# EAGLE design pic18f46k22_evb (EAGLE 7.0.0)
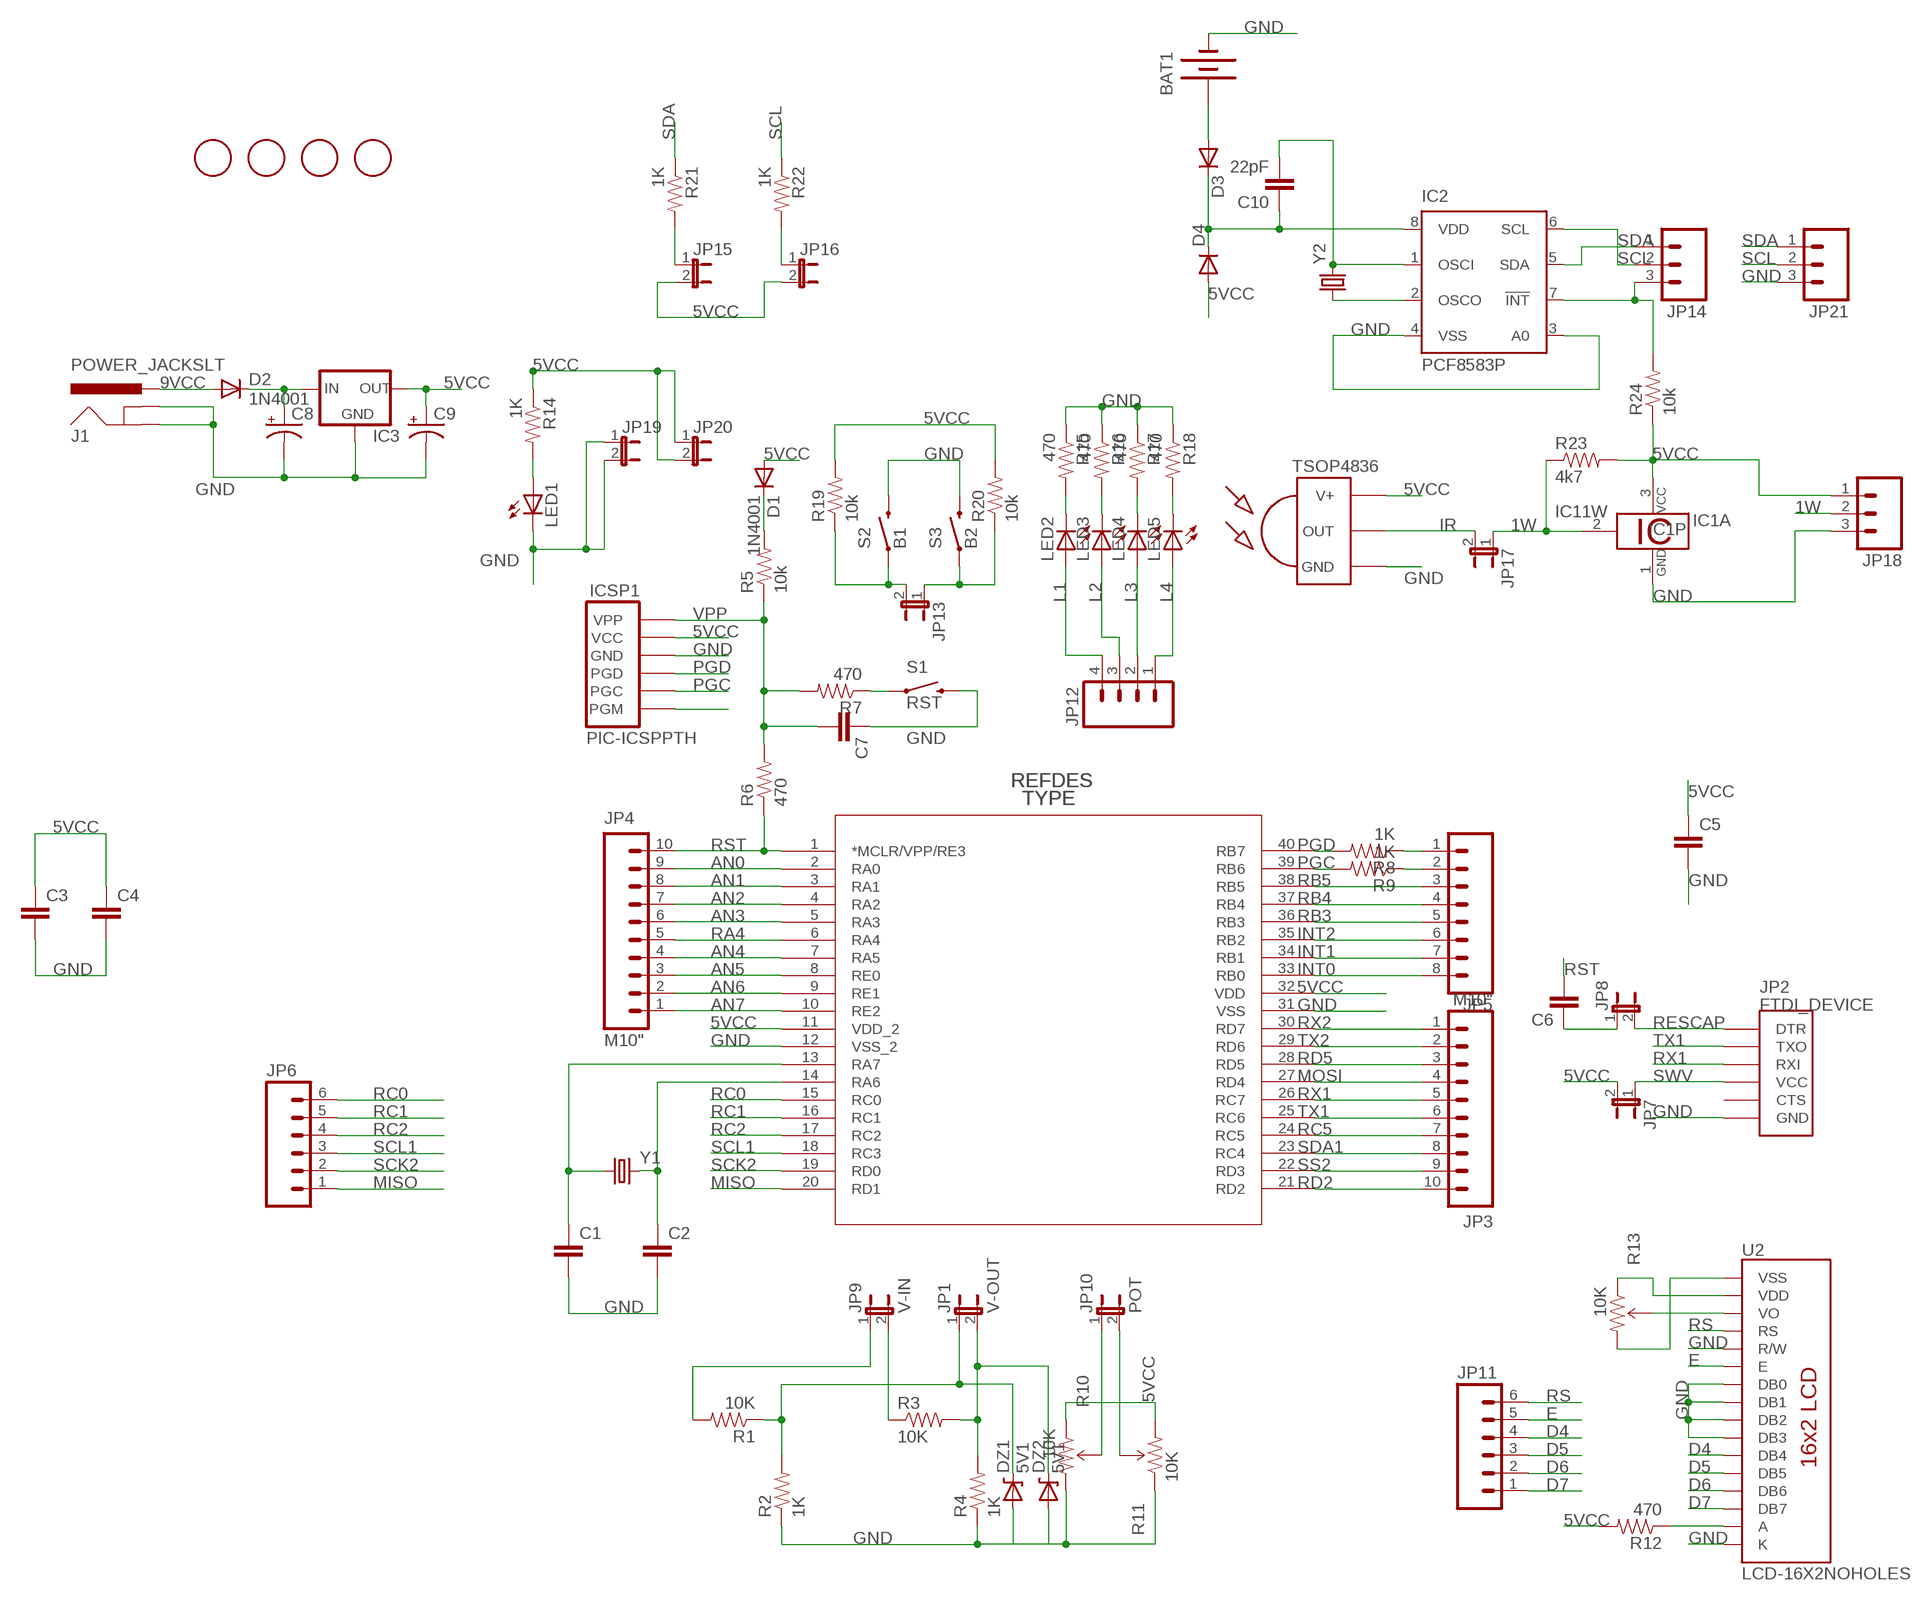
[diagram p0: schematic, sheet 1]

## Parts
BAT1  BATTERY12MM  [BATTCON_12MM]
C1  CAPPTH1  [CAP-PTH-5MM]
C2  CAPPTH1  [CAP-PTH-5MM]
C3  CAPPTH1  [CAP-PTH-5MM]
C4  CAPPTH1  [CAP-PTH-5MM]
C5  CAPPTH1  [CAP-PTH-5MM]
C6  CAPPTH1  [CAP-PTH-5MM]
C7  CAPPTH1  [CAP-PTH-5MM]
C8  CAP_POLPTH1  [CPOL-RADIAL-100UF-25V]
C9  CAP_POLPTH2  [CPOL-RADIAL-10UF-25V]
C10  22pF  CAPPTH1  [CAP-PTH-5MM]
D1  1N4001  DIODEPTH  [DIODE-1N4001]
D2  1N4001  DIODEPTH  [DIODE-1N4001]
D3  DIODE1N4148  [DIODE-1N4148]
D4  DIODE1N4148  [DIODE-1N4148]
DZ1  5V1  DIODE-ZENERPTH  [DIODE-ZENER]
DZ2  5V1  DIODE-ZENERPTH  [DIODE-ZENER]
IC1  DS18B20  [TO92-]
IC2  PCF8583P  [DIL08]
IC3  V_REG_78XXSINK  [TO220-IGO]
ICSP1  PIC-ICSPPTH  [MOLEX-1X6]
J1  POWER_JACKSLT  [POWER_JACK_SLOT]
JP1  V-OUT  JUMPER-2PTH  [1X02]
JP2  FTDI_DEVICE  [FTDI_DEVICE_SIDE]
JP3  M10"  [1X10]
JP4  M10"  [1X10]
JP5  M081X08  [1X08]
JP6  M06SIP  [1X06]
JP7  JUMPER-2PTH  [1X02]
JP8  JUMPER-2PTH  [1X02]
JP9  V-IN  JUMPER-2PTH  [1X02]
JP10  POT  JUMPER-2PTH  [1X02]
JP11  M06SIP  [1X06]
JP12  M04PTH  [1X04]
JP13  JUMPER-2PTH  [1X02]
JP14  M03PTH  [1X03]
JP15  JUMPER-2PTH  [1X02]
JP16  JUMPER-2PTH  [1X02]
JP17  JUMPER-2PTH  [1X02]
JP18  M03PTH  [1X03]
JP19  JUMPER-2PTH  [1X02]
JP20  JUMPER-2PTH  [1X02]
JP21  M03PTH  [1X03]
LED1  LED3MM  [LED3MM]
LED2  LED3MM  [LED3MM]
LED3  LED3MM  [LED3MM]
LED4  LED3MM  [LED3MM]
LED5  LED3MM  [LED3MM]
R1  10K  RESISTORAXIAL-0.3  [AXIAL-0.3]
R2  1K  RESISTORAXIAL-0.3  [AXIAL-0.3]
R3  10K  RESISTORAXIAL-0.3  [AXIAL-0.3]
R4  1K  RESISTORAXIAL-0.3  [AXIAL-0.3]
R5  10k  RESISTORAXIAL-0.3  [AXIAL-0.3]
R6  470  RESISTORAXIAL-0.3  [AXIAL-0.3]
R7  470  RESISTORAXIAL-0.3  [AXIAL-0.3]
R8  1K  RESISTORAXIAL-0.3  [AXIAL-0.3]
R9  1K  RESISTORAXIAL-0.3  [AXIAL-0.3]
R10  10K  TRIMPOTPTH  [TRIM_POT_PTH]
R11  10K  TRIMPOTPTH  [TRIM_POT_PTH]
R12  470  RESISTORAXIAL-0.3  [AXIAL-0.3]
R13  10K  TRIMPOTPTH  [TRIM_POT_PTH]
R14  1K  RESISTORAXIAL-0.3  [AXIAL-0.3]
R15  470  RESISTORAXIAL-0.3  [AXIAL-0.3]
R16  470  RESISTORAXIAL-0.3  [AXIAL-0.3]
R17  470  RESISTORAXIAL-0.3  [AXIAL-0.3]
R18  470  RESISTORAXIAL-0.3  [AXIAL-0.3]
R19  10k  RESISTORAXIAL-0.3  [AXIAL-0.3]
R20  10k  RESISTORAXIAL-0.3  [AXIAL-0.3]
R21  1K  RESISTORAXIAL-0.3  [AXIAL-0.3]
R22  1K  RESISTORAXIAL-0.3  [AXIAL-0.3]
R23  4k7  RESISTORAXIAL-0.3  [AXIAL-0.3]
R24  10k  RESISTORAXIAL-0.3  [AXIAL-0.3]
S1  RST  SWITCH-MOMENTARY-2PTH  [TACTILE-PTH]
S2  B1  SWITCH-MOMENTARY-2PTH  [TACTILE-PTH]
S3  B2  SWITCH-MOMENTARY-2PTH  [TACTILE-PTH]
U1  PIC18F46K22  MICROCHIP_PIC18F46K22-X_P  [MICROCHIP_PDIP40_600MC]
U2  LCD-16X2NOHOLES  [LCD-16X2_NOHOLES]
U$1  MOUNTINGHOLE3.0THIN  [MOUNTINGHOLE_3.0_PLATEDTHIN]
U$2  MOUNTINGHOLE3.0THIN  [MOUNTINGHOLE_3.0_PLATEDTHIN]
U$3  MOUNTINGHOLE3.0THIN  [MOUNTINGHOLE_3.0_PLATEDTHIN]
U$4  MOUNTINGHOLE3.0THIN  [MOUNTINGHOLE_3.0_PLATEDTHIN]
U$5  TSOP4836  [TSOP18XX]
Y1  CRYSTALHC49UV  [HC49U-V]
Y2  CRYSTALTC38H  [TC38H]

## Nets
1W: IC1.2 JP17.1 JP18.2 R23.P$1
5VCC: C3.1 C4.1 C5.1 C9.1(+) D1.A D4.A IC1.3 IC3.OUT ICSP1.5(VCC) JP7.2 JP15.2 JP16.2 JP18.1 JP20.1 JP20.2 R10.1(CCW) R11.3(CW) R12.P$2 R13.1(CCW) R14.P$1 R19.P$2 R20.P$2 R23.P$2 R24.P$1 U1.11(VDD_2) U1.32(VDD) U2.2(VDD) U$5.VCC(V+)
9VCC: D2.A J1.PWR
AN0: JP4.9 U1.2(RA0)
AN1: JP4.8 U1.3(RA1)
AN2: JP4.7 U1.4(RA2)
AN3: JP4.6 U1.5(RA3)
AN4: JP4.4 U1.7(RA5)
AN5: JP4.3 U1.8(RE0)
AN6: JP4.2 U1.9(RE1)
AN7: JP4.1 U1.10(RE2)
D4: JP11.4 U2.11(DB4)
D5: JP11.3 U2.12(DB5)
D6: JP11.2 U2.13(DB6)
D7: JP11.1 U2.14(DB7)
E: JP11.5 U2.6(E)
GND: BAT1.GND(-) C1.2 C2.2 C3.2 C4.2 C5.2 C7.1 C8.2(-) C9.2(-) DZ1.P$2(A) DZ2.P$2(A) IC1.1 IC2.3(A0) IC2.4(VSS) IC3.GND ICSP1.4(GND) J1.GND@1(GNDBREAK) J1.GND@2(GND) JP2.P$6(GND) JP18.3 JP19.1 JP19.2 JP21.3 LED1.K(C) R2.P$1 R4.P$1 R10.3(CW) R11.1(CCW) R13.3(CW) R15.P$1 R16.P$1 R17.P$1 R18.P$1 S1.3 S2.3 S3.3 U1.12(VSS_2) U1.31(VSS) U2.1(VSS) U2.5(R/W) U2.7(DB0) U2.8(DB1) U2.9(DB2) U2.10(DB3) U2.16(K) U$5.GND
INT0: JP5.8 U1.33(RB0)
INT1: JP5.7 U1.34(RB1)
INT2: JP5.6 U1.35(RB2)
IR: JP17.2 U$5.OUT
L1: JP12.4 LED2.A
L2: JP12.3 LED3.A
L3: JP12.2 LED4.A
L4: JP12.1 LED5.A
MISO: JP6.1 U1.20(RD1)
MOSI: JP3.4 U1.27(RD4)
N$1: C1.1 U1.13(RA7) Y1.1
N$2: C2.1 U1.14(RA6) Y1.2
N$3: D1.C R5.P$2
N$4: R7.P$1 S1.1
N$5: JP5.1 R8.P$1
N$6: JP5.2 R9.P$1
N$7: C6.1 JP8.1
N$8: IC2.2(OSCO) Y2.1
N$9: DZ1.P$1(C) JP1.1 R1.P$1 R2.P$2
N$10: DZ2.P$1(C) JP1.2 R3.P$2 R4.P$2
N$11: ICSP1.1(PGM)
N$12: JP9.2 R3.P$1
N$13: JP9.1 R1.P$2
N$14: C10.2 IC2.1(OSCI) Y2.2
N$15: JP10.1 R10.2(WIPER)
N$16: JP10.2 R11.2(WIPER)
N$17: C8.1(+) D2.C IC3.IN
N$18: R13.2(WIPER) U2.3(VO)
N$19: LED1.A R14.P$2
N$20: LED2.K(C) R15.P$2
N$21: LED3.K(C) R16.P$2
N$22: LED4.K(C) R17.P$2
N$23: LED5.K(C) R18.P$2
N$24: JP13.2 R19.P$1 S2.1
N$25: R12.P$1 U2.15(A)
N$26: JP13.1 R20.P$1 S3.1
N$27: BAT1.PWR@1(+) D3.A
N$28: JP15.1 R21.P$2
N$29: C10.1 D3.C D4.C IC2.8(VDD)
N$30: IC2.7(!INT) JP14.3 R24.P$2
N$31: JP16.1 R22.P$2
PGC: ICSP1.2(PGC) R9.P$2 U1.39(RB6)
PGD: ICSP1.3(PGD) R8.P$2 U1.40(RB7)
RA4: JP4.5 U1.6(RA4)
RB3: JP5.5 U1.36(RB3)
RB4: JP5.4 U1.37(RB4)
RB5: JP5.3 U1.38(RB5)
RC0: JP6.6 U1.15(RC0)
RC1: JP6.5 U1.16(RC1)
RC2: JP6.4 U1.17(RC2)
RC5: JP3.7 U1.24(RC5)
RD2: JP3.10 U1.21(RD2)
RD5: JP3.3 U1.28(RD5)
RESCAP: JP2.P$1(DTR) JP8.2
RS: JP11.6 U2.4(RS)
RST: C6.2 JP4.10 R6.P$1 U1.1(*MCLR/VPP/RE3)
RX1: JP2.P$3(RXI) JP3.5 U1.26(RC7)
RX2: JP3.1 U1.30(RD7)
SCK2: JP6.2 U1.19(RD0)
SCL: IC2.6(SCL) JP14.2 JP21.2 R22.P$1
SCL1: JP6.3 U1.18(RC3)
SDA: IC2.5(SDA) JP14.1 JP21.1 R21.P$1
SDA1: JP3.8 U1.23(RC4)
SS2: JP3.9 U1.22(RD3)
SWV: JP2.P$4(VCC) JP7.1
TX1: JP2.P$2(TXO) JP3.6 U1.25(RC6)
TX2: JP3.2 U1.29(RD6)
VPP: C7.2 ICSP1.6(VPP) R5.P$1 R6.P$2 R7.P$2
Unconnected: JP2.P$5(CTS)

## Library data of the parts
BAT1 = SparkFun-Electromechanical:BATTERY: Battery Holders Various common sizes : AA, AAA, 20mm coin cell and 12mm coin cell. 20MM_4LEGS, BATT-10373
C1-C7 C10 = SparkFun-Passives:CAP: Capacitor Standard 0603 ceramic capacitor, and 0.1" leaded capacitor.
C8 C9 = SparkFun-Capacitors:CAP_POL: Capacitor Polarized These are standard SMD and PTH capacitors. Normally 10uF, 47uF, and 100uF in electrolytic and tantalum varieties. Always verify the external diameter of the through hole cap, it varies with capacity, voltage, and manufacturer. The EIA devices should be standard.
D1-D4 = SparkFun-DiscreteSemi:DIODE: Diode These are standard reverse protection diodes and small signal diodes. SMA package can handle up to about 1A. SOD-323 can handle about 200mA. What the SOD-323 package when ordering, there are some mfgs out there that are 5-pin packages.
DZ1 DZ2 = SparkFun-DiscreteSemi:DIODE-ZENER: Zener Diode Production Part - 8199 3.4V Zener Voltage
IC1 = 1wire:DS18B20: Programmable Resolution Digital Thermometer This chip provides a onewire thermosensor with approx. 0.5°C accuracy. A programmable over/undertemperure alarm is available. The precision can be set from 9..12 bits. Notes: Vdd must be applied for accurate measurements at low temperatures, as the parasite power circuit otherwise heats the sensor. If parasite power is used, Vdd has to be connected to GND. The DS1822 is a low-cost thermometer chip, the DS18S20 is similar to the DS18B20, but with 9 Bit precision only. Author: Jan Kandziora <jjj@gmx.de>
IC2 = ds1307_pcf8583:PCF8583: I2C-Bus CLOCK/CALENDAR
IC3 = SparkFun-PowerIC:V_REG_78XX: Voltage Regulator Standard 7805 5V regulator. IGO (Input Ground Output). Spark Fun Electronics SKU : COM-00107
ICSP1 = SparkFun-Connectors:PIC-ICSP: ISCP Programming connector for UAV, UBW Kit, etc.
J1 = SparkFun-Connectors:POWER_JACK: Power Jack This is the standard 5.5mm barrel jack for power. The PTH is the most common, proven, reliable, footprint. The Slot footprint only works if the mill layer is transmitted to the PCB fab house so be warned. Spark Fun Electronics SKU : PRT-00119 SMT: CONN-08106 Mating wall wart : TOL-00298 (and others)
JP1 JP7-JP10 JP13 JP15-JP17 JP19 JP20 = SparkFun-Passives:JUMPER-2: Jumper Basic 0.1" spaced jumper. Use with breakaway headers.
JP2 = SparkFun-Connectors:FTDI_DEVICE: Connector which mates to FTDI basic or FTDI cable.
JP3 JP4 = SparkFun-Connectors:M10: Header 10 Standard 10-pin 0.1" header. Use with straight break away headers (SKU : PRT-00116), right angle break away headers (PRT-00553), swiss pins (PRT-00743), machine pins (PRT-00117), and female headers (PRT-00115).
JP5 = SparkFun-Connectors:M08: Header 8 Standard 8-pin 0.1" header. Use with straight break away headers (SKU : PRT-00116), right angle break away headers (PRT-00553), swiss pins (PRT-00743), machine pins (PRT-00117), and female headers (PRT-00115).
JP6 JP11 = SparkFun-Connectors:M06: Header 6 Standard 6-pin 0.1" header. Use with straight break away headers (SKU : PRT-00116), right angle break away headers (PRT-00553), swiss pins (PRT-00743), machine pins (PRT-00117), and female headers (PRT-00115). Molex polarized connector foot print use with SKU : PRT-08094 with associated crimp pins and housings. NOTES ON THE VARIANTS LOCK and LOCK_LONGPADS... This footprint was designed to help hold the alignment of a through-hole component (i.e. 6-pin header) while soldering it into place. You may notice that each hole has been shifted either up or down by 0.005 of an inch from it's more standard position (which is a perfectly straight line). This slight alteration caused the pins (the squares in the middle) to touch the edges of the holes. Because they are alternating, it causes a "brace" to hold the component in place. 0.005 has proven to be the perfect amount of "off-center" position when using our standard breakaway headers. Although looks a little odd when you look at the bare footprint, once you have a header in there, the alteration is very hard to notice. Also, if you push a header all the way into place, it is covered up entirely on the bottom side. This idea of altering the position of holes to aid alignment will be further integrated into the Sparkfun Library for other footprints. It can help hold any component with 3 or more connection pins.
JP12 = SparkFun-Connectors:M04: Header 4 Standard 4-pin 0.1" header. Use with straight break away headers (SKU : PRT-00116), right angle break away headers (PRT-00553), swiss pins (PRT-00743), machine pins (PRT-00117), and female headers (PRT-00115). Molex polarized connector foot print use with SKU : PRT-08231 with associated crimp pins and housings. 1MM SMD Version SKU: PRT-10208
JP14 JP18 JP21 = SparkFun-Connectors:M03: Header 3 Standard 3-pin 0.1" header. Use with straight break away headers (SKU : PRT-00116), right angle break away headers (PRT-00553), swiss pins (PRT-00743), machine pins (PRT-00117), and female headers (PRT-00115). Molex polarized connector foot print use with SKU : PRT-08232 with associated crimp pins and housings.
LED1-LED5 = SparkFun-LED:LED: LEDs Standard schematic elements and footprints for 5mm, 3mm, 1206, and 0603 sized LEDs. 5mm - Spark Fun Electronics SKU : COM-00529 (and others)
R1 R3 R4 R6-R9 R12 R14-R18 R21-R23 = SparkFun-Passives:RESISTOR: Resistor Basic schematic elements and footprints for 0603, 1206, and PTH resistors.
R2 R5 R19 R20 R24 = SparkFun-Resistors:RESISTOR: Resistor Basic schematic elements and footprints for 0603, 1206, and PTH resistors.
R10 R11 R13 = SparkFun-Electromechanical:TRIMPOT: Various small potentiometers for "set-and-forget" applications
S1-S3 = SparkFun-Electromechanical:SWITCH-MOMENTARY-2: Various NO switches- pushbuttons, reed, etc
U1 = pic18f46k22_evb:MICROCHIP_PIC18F46K22-X_P
U2 = SparkFun-Displays:LCD-16X2: Standard text-only 16x2 parallel input LCD
U$1-U$4 = microbuilder:MOUNTINGHOLE: Mounting Hole
U$5 = tsop-1:TSOP4836: IR Receiver and Demodulator
Y1 Y2 = SparkFun-FreqCtrl:CRYSTAL: Various standard crystals. Proven footprints. Spark Fun Electronics SKU : COM-00534

## Board
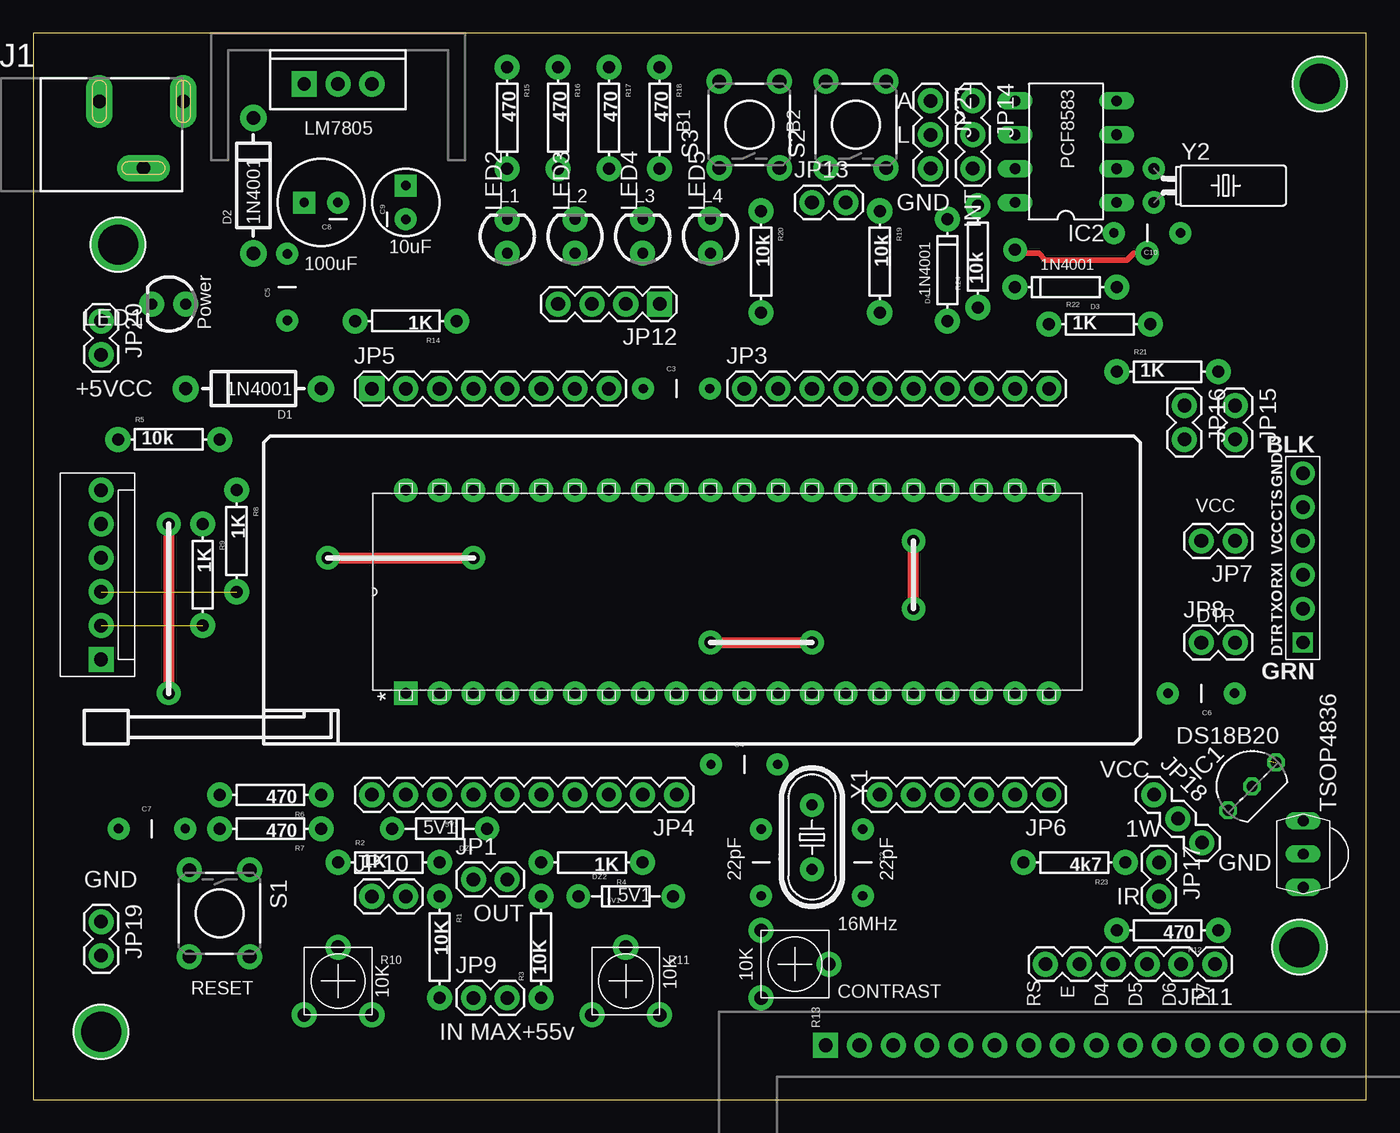
[diagram p1: board, top side]
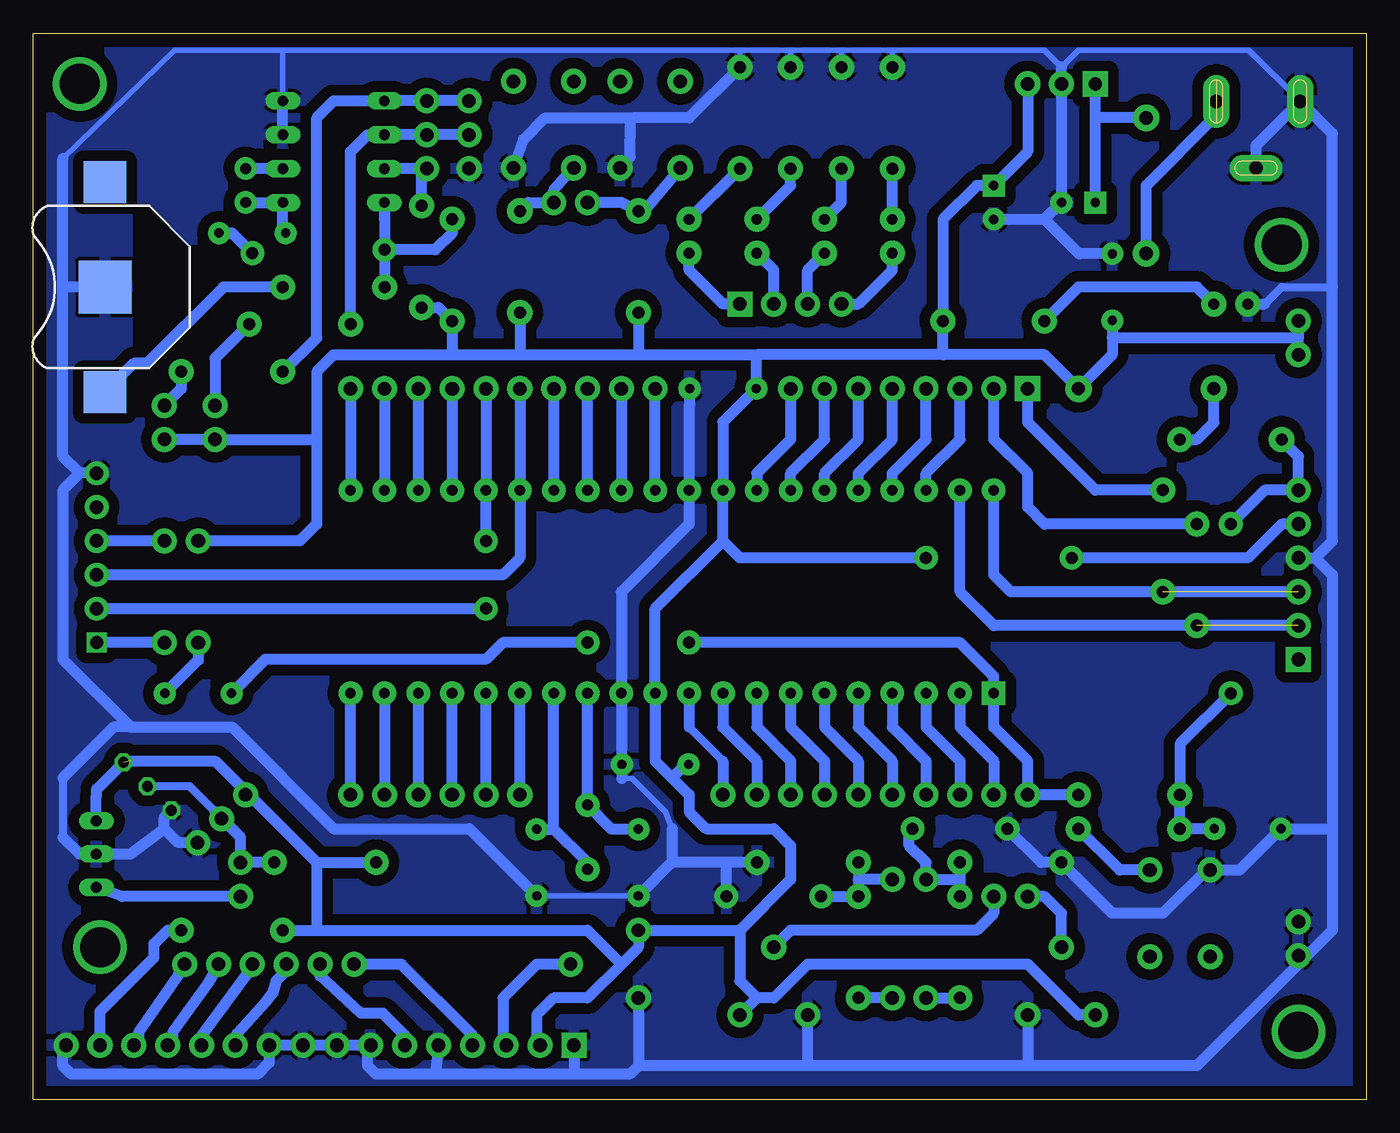
[diagram p2: board, bottom side, seen from below]

Size 100 x 80 mm. Coordinates in mm from the lower left corner, seen from the top.
Outline: 0,0 100,0 100,80 0,80 0,0
Copper layers (1*16): Top 0.035mm / dielectric 1.5mm / Bottom 0.035mm
Design rules "default *": minimum track width 10mil, minimum drill 24mil, track to track 32mil, track to pad 32mil, pad to pad 16mil, via to via 16mil, smd to smd 8mil, copper to edge 40mil, drill to drill 8mil, minimum pad ring 10mil, minimum via ring 8mil, stop-mask expansion 4mil, vias tented up to drill 0mil, thermal gap 10mil
bRestrict: area 87,56.5 to 92.1,66.7

### Footprints (pad centres in the part's own frame; a part is rotated, then mirrored left to right if it is on the bottom)
BATTCON_12MM = smd 3.962 x 3.962: GND 0,0 | smd 3.175 x 3.175: PWR@1 -7.874,0; PWR@2 7.874,0
CAP-PTH-5MM = drill 0.7 pad 1.651: 1 -2.5,0; 2 2.5,0
CPOL-RADIAL-100UF-25V = drill 0.7 pad 1.651 square: 1 1.27,0 | drill 0.7 pad 1.651: 2 -1.27,0
CPOL-RADIAL-10UF-25V = drill 0.7 pad 1.651 square: 1 1.27,0 | drill 0.7 pad 1.651: 2 -1.27,0
DIODE-1N4001 = drill 1 pad 1.981: A -5.08,0; C 5.08,0
DIODE-1N4148 = drill 0.9 pad 1.88: A -3.81,0; C 3.81,0
DIODE-ZENER = drill 0.9 pad 1.778: P$1 -3.556,0; P$2 3.556,0
TO92- = drill 0.813 octagon: 1 -2.54,0; 2 0,0; 3 2.54,0
DIL08 = drill 0.813 long: 1 -3.81,-3.81; 2 -1.27,-3.81; 3 1.27,-3.81; 4 3.81,-3.81; 5 3.81,3.81; 6 1.27,3.81; 7 -1.27,3.81; 8 -3.81,3.81
TO220-IGO = drill 1 pad 1.88: GND 0,0; OUT 2.54,0 | drill 1 pad 1.88 square: IN -2.54,0
MOLEX-1X6 = drill 1.016 pad 1.88 square: 1 0,0 | drill 1.016 pad 1.88: 2 2.54,0; 3 5.08,0; 4 7.62,0; 5 10.16,0; 6 12.7,0
POWER_JACK_SLOT = drill 1 pad 2 long: GND@1 2.58,7.5; GND@2 7.58,10.8; PWR 2.58,13.8
1X02 = drill 1.016 pad 1.88: 1 0,0; 2 2.54,0
FTDI_DEVICE_SIDE = drill 1 square: P$1 -6.35,0 | drill 1.016 pad 1.778: P$2 -3.81,0; P$3 -1.27,0; P$4 1.27,0; P$5 3.81,0; P$6 6.35,0
1X10 = drill 1.016 pad 1.88: 1 0,0; 2 2.54,0; 3 5.08,0; 4 7.62,0; 5 10.16,0; 6 12.7,0; 7 15.24,0; 8 17.78,0; 9 20.32,0; 10 22.86,0
1X08 = drill 1.016 pad 1.88 square: 1 0,0 | drill 1.016 pad 1.88: 2 2.54,0; 3 5.08,0; 4 7.62,0; 5 10.16,0; 6 12.7,0; 7 15.24,0; 8 17.78,0
1X06 = drill 1.016 pad 1.88: 1 0,0; 2 2.54,0; 3 5.08,0; 4 7.62,0; 5 10.16,0; 6 12.7,0
1X04 = drill 1.016 pad 1.88 square: 1 0,0 | drill 1.016 pad 1.88: 2 2.54,0; 3 5.08,0; 4 7.62,0
1X03 = drill 1.016 pad 1.88: 1 0,0; 2 2.54,0; 3 5.08,0
LED3MM = drill 0.813 pad 1.88: A -1.27,0; K 1.27,0
AXIAL-0.3 = drill 0.9 pad 1.88: P$1 -3.81,0; P$2 3.81,0
TRIM_POT_PTH = drill 1 pad 1.88: 1 -2.54,-2.54; 2 0,2.54; 3 2.54,-2.54
TACTILE-PTH = drill 1.016 pad 1.88: 1 -3.251,2.261; 2 3.251,2.261; 3 -3.251,-2.261; 4 3.251,-2.261
MICROCHIP_PDIP40_600MC = drill 0.8 pad 1.778 square: 1 -15.24,48.26 | drill 0.8 pad 1.778: 2 -15.24,45.72; 3 -15.24,43.18; 4 -15.24,40.64; 5 -15.24,38.1; 6 -15.24,35.56; 7 -15.24,33.02; 8 -15.24,30.48; 9 -15.24,27.94; 10 -15.24,25.4; 11 -15.24,22.86; 12 -15.24,20.32; 13 -15.24,17.78; 14 -15.24,15.24; 15 -15.24,12.7; 16 -15.24,10.16; 17 -15.24,7.62; 18 -15.24,5.08; 19 -15.24,2.54; 20 -15.24,0; 21 0,0; 22 0,2.54; 23 0,5.08; 24 0,7.62; 25 0,10.16; 26 0,12.7; 27 0,15.24; 28 0,17.78; 29 0,20.32; 30 0,22.86; 31 0,25.4; 32 0,27.94; 33 0,30.48; 34 0,33.02; 35 0,35.56; 36 0,38.1; 37 0,40.64; 38 0,43.18; 39 0,45.72; 40 0,48.26
LCD-16X2_NOHOLES = drill 1.016 pad 1.88 square: 1 -32,15.5 | drill 1.016 pad 1.88: 2 -29.46,15.5; 3 -26.92,15.5; 4 -24.38,15.5; 5 -21.84,15.5; 6 -19.3,15.5; 7 -16.76,15.5; 8 -14.22,15.5; 9 -11.68,15.5; 10 -9.14,15.5; 11 -6.6,15.5; 12 -4.06,15.5; 13 -1.52,15.5; 14 1.02,15.5; 15 3.56,15.5; 16 6.1,15.5
MOUNTINGHOLE_3.0_PLATEDTHIN = drill 3 pad 3.6: P$1 0,0
TSOP18XX = drill 0.813 long: GND -0.001,-0.027; OUT -2.501,-0.027; VCC 2.499,-0.027
HC49U-V = drill 0.813 pad 1.778: 1 -2.413,0; 2 2.413,0
TC38H = drill 0.813 pad 1.676: 1 -1.27,0; 2 1.27,0

### Placement (x,y rotation side)
BAT1  94.61,60.96 90 bottom
C1  54.61,17.78 270 top
C2  62.23,17.78 270 top
C3  48.26,53.34 0 top
C4  53.34,25.15 0 top
C5  19.05,60.96 90 top
C6  87.63,30.48 180 top
C7  8.89,20.32 0 top
C8  21.59,67.31 180 top
C9  27.94,67.31 90 top
C10  83.57,65.02 180 top
D1  16.51,53.34 180 top
D2  16.51,68.58 90 top
D3  77.47,60.96 180 top
D4  68.58,62.23 90 top
DZ1  30.48,20.32 180 top
DZ2  44.45,15.24 0 top
IC1  91.44,23.5 45 top
IC2  77.47,71.12 90 top
IC3  22.86,76.2 0 top
ICSP1  5.08,33.02 90 top
J1  -2.54,77.47 270 top
JP1  33.02,16.51 0 top
JP2  95.25,40.64 90 top
JP3  53.34,53.34 0 top
JP4  48.26,22.86 180 top
JP5  25.4,53.34 0 top
JP6  76.2,22.86 180 top
JP7  90.17,41.91 180 top
JP8  87.63,34.29 0 top
JP9  33.02,7.62 0 top
JP10  25.4,15.24 0 top
JP11  88.65,10.16 180 top
JP12  46.99,59.69 180 top
JP13  58.42,67.31 0 top
JP14  70.48,74.93 270 top
JP15  90.17,52.07 270 top
JP16  86.36,52.07 270 top
JP17  84.45,17.78 270 top
JP18  84.08,22.86 315 top
JP19  5.08,13.34 270 top
JP20  5.08,58.42 270 top
JP21  67.31,74.93 270 top
LED1  10.16,59.69 180 top
LED2  35.56,64.77 90 top
LED3  40.64,64.77 90 top
LED4  45.72,64.77 90 top
LED5  50.8,64.77 90 top
R1  30.48,11.43 270 top
R2  26.67,17.78 0 top
R3  38.1,11.43 90 top
R4  41.91,17.78 180 top
R5  10.16,49.53 0 top
R6  17.78,22.86 180 top
R7  17.78,20.32 180 top
R8  15.24,41.91 270 top
R9  12.7,39.37 270 top
R10  22.86,8.89 0 top
R11  44.45,8.89 0 top
R12  85.09,12.7 180 top
R13  57.15,10.16 270 top
R14  27.94,58.42 180 top
R15  35.56,73.66 270 top
R16  39.37,73.66 270 top
R17  43.18,73.66 270 top
R18  46.99,73.66 270 top
R19  63.5,62.87 270 top
R20  54.61,62.87 270 top
R21  85.09,54.61 0 top
R22  80.01,58.17 0 top
R23  78.11,17.78 180 top
R24  70.87,63.25 90 top
S1  13.97,13.97 270 top
S2  61.72,73.15 90 top
S3  53.72,73.15 90 top
U1  76.2,45.72 90 top
U2  91.44,-11.43 0 top
U$1  6.35,64.14 0 top
U$2  96.52,76.2 0 top
U$3  95,11.43 0 top
U$4  5.08,5.08 0 top
U$5  95.25,18.41 90 top
Y1  58.42,19.68 270 top
Y2  84.07,68.58 270 top

### Tracks (layer width: path | path; a pad name or v marks a point on that pad's centre or on a via)
1W
  Bottom 0.61: 86.36,21.59 88.27,23.5 IC1.2
  Bottom 0.813: R23.P$1 JP17.1 84.45,19.68 85.88,21.11 | JP18.2 85.88,21.11 | 85.88,21.11 86.36,21.59
5VCC  (via drill 0.9 pad 1.78)  (1 unrouted)
  Top 0.813: v22.1,40.64 v33.02,40.64
  Bottom 0.813: 48.26,41.91 53.34,36.83 U1.11 53.34,25.4 52.07,24.13 | 48.26,41.91 U1.32 48.26,50.84 C3.1 45.76,55.84 45.72,55.88 | ICSP1.5 6.35,43.18 8.89,40.64 v22.1,40.64 | v33.02,40.64 46.99,40.64 48.26,41.91 | 52.07,24.13 50.8,22.86 50.8,21.59 49.53,20.32 44.45,20.32 43.18,19.05 43.18,16.51 46.99,12.7 | C4.1 50.84,25.36 52.07,24.13 | 31.75,55.88 45.72,55.88 | 68.58,55.88 77.47,55.88 78.74,54.61 78.74,49.53 | 68.58,55.88 63.5,55.88 | 63.5,55.88 54.61,55.88 | 54.61,55.88 45.72,55.88 | R10.1 21.59,6.35 25.4,10.16 41.91,10.16 44.45,7.62 45.72,7.62 | 45.72,7.62 R11.3 | 46.99,12.7 46.99,8.89 45.72,7.62 | 55.88,10.16 54.61,11.43 R13.1 46.99,12.7 | 55.88,10.16 58.42,7.62 60.96,7.62 62.23,6.35 62.23,4.32 U2.2 | R12.P$2 78.74,12.7 | 78.74,12.7 58.42,12.7 55.88,10.16 | IC3.OUT 25.4,71.12 C9.1 29.21,68.58 31.75,66.04 R14.P$1 31.75,55.88 | 31.75,55.88 24.13,55.88 D1.A 19.05,55.88 19.05,57.15 | R20.P$2 54.61,55.88 | R19.P$2 63.5,55.88 | 68.58,55.88 D4.A 69.6,59.44 R24.P$1 | JP15.2 JP16.2 78.74,49.53 | C5.1 19.05,57.15 | 78.74,17.78 R23.P$2 | 78.74,17.78 78.74,12.7 | U$5.VCC 95.28,22.83 95.25,22.86 95.25,23.28 IC1.3 | 92.71,25.4 86.36,25.4 84.08,23.12 | 84.08,23.12 78.74,17.78 | JP18.1 84.08,23.12 | JP20.1 5.08,57.15 | JP20.2 5.08,57.15 | 5.08,57.15 19.05,57.15 | 78.74,49.53 78.74,43.18 80.01,41.91 JP7.2
9VCC
  Bottom 0.813: D2.A 16.51,68.58 11.43,73.66 11.43,74.72 J1.PWR
AN0
  Bottom 0.813: U1.2 30.48,27.94 27.94,25.4 JP4.9
AN1
  Bottom 0.813: U1.3 33.02,27.94 30.48,25.4 JP4.8
AN2
  Bottom 0.813: U1.4 35.56,27.94 33.02,25.4 JP4.7
AN3
  Bottom 0.813: U1.5 38.1,27.94 35.56,25.4 JP4.6
AN4
  Bottom 0.813: U1.7 43.18,27.94 40.64,25.4 JP4.4
AN5
  Bottom 0.813: U1.8 45.72,27.94 43.18,25.4 JP4.3
AN6
  Bottom 0.813: U1.9 48.26,27.94 45.72,25.4 JP4.2
AN7
  Bottom 0.61: 50.8,27.94 48.26,25.4
  Bottom 0.813: U1.10 50.8,27.94 | 48.26,25.4 JP4.1
D4
  Bottom 0.813: JP11.4 81.15,9.54 81.79,8.89 82.04,8 82.55,7.37 84.71,4.95 U2.11
D5
  Bottom 0.813: JP11.3 84.07,9.27 87.63,4.45 87.63,4.32 U2.12
D6
  Bottom 0.813: JP11.2 86.87,8.76 89.53,5.08 89.53,4.46 U2.13
D7
  Bottom 0.813: JP11.1 89.15,9.27 92.08,5.08 92.08,4.46 U2.14
E
  Bottom 0.813: U2.6 72.14,4.83 73.79,6.48 75.44,6.48 78.49,9.27 JP11.5
GND
  Bottom 0.406: C1.2 C2.2 | 35.56,78.74 24.13,78.74 22.86,77.47 21.59,78.74 8.81,78.74 J1.GND@1 | 35.56,78.74 39.37,78.74 | 39.37,78.74 43.18,78.74 | 43.18,78.74 46.99,78.74 | 46.99,78.74 81.28,78.74 | R15.P$1 35.56,78.74 | R16.P$1 39.37,78.74 | R17.P$1 43.18,78.74 | R18.P$1 46.99,78.74 | IC2.4 81.28,78.74 | 97.79,70.61 89.41,78.74 81.28,78.74 | 52.07,20.32 52.58,21.59 55.08,24.09 55.84,24.09
  Bottom 0.61: 7.62,59.69 6.35,60.96 2.54,60.96 | 97.79,24.13 97.79,19.68
  Bottom 0.813: 3.81,40.64 2.54,39.37 2.54,20.32 | 2.54,20.32 2.54,12.7 12.7,2.54 25.4,2.54 | 25.4,2.54 41.91,2.54 | 41.91,2.54 54.61,2.54 | ICSP1.4 3.81,40.64 | 3.81,40.64 2.54,41.91 2.54,60.96 2.54,72.47 J1.GND@1 8.26,71.59 J1.GND@2 | 2.54,20.32 C7.1 9.49,17.22 S1.3 11.71,17.5 15.24,13.97 19.05,13.97 R2.P$1 24.38,17.78 DZ1.P$2 | 55.84,24.09 C4.2 55.84,30.44 U1.12 55.88,38.1 50.8,43.18 U1.31 50.8,52.07 50.76,52.11 C3.2 | 52.07,20.32 52.07,17.82 | 52.07,17.82 C1.2 54.61,15.24 | 96.52,46.99 97.79,45.72 97.79,33.02 92.71,27.94 | 92.71,27.94 85.09,27.94 77.47,20.32 67.27,20.32 C2.2 | R10.3 25.4,2.54 | R11.1 41.91,2.54 | R4.P$1 48.26,17.78 | 48.26,17.78 52.03,17.78 52.07,17.82 | U2.16 97.79,3.82 97.79,2.54 97.16,1.91 83.19,1.91 82.3,2.79 U2.10 U2.9 U2.8 U2.7 74.93,3.82 74.93,2.54 74.3,1.91 69.85,1.91 | U2.5 69.85,1.91 | 54.61,2.54 55.24,1.91 59.69,1.91 | 59.69,1.91 69.85,1.91 | U2.1 59.44,2.15 59.69,1.91 | R13.3 54.61,2.54 | 22.86,77.47 IC3.GND C8.2 24.13,66.04 | C9.2 24.13,66.04 | LED1.K 7.62,59.69 | S2.3 63.22,72.03 61.59,73.66 55.24,73.66 55.19,73.48 | R18.P$1 50.8,73.66 55.01,73.66 55.19,73.48 | S3.3 55.22,70.71 55.19,73.48 | JP2.P$6 96.52,46.99 | 96.52,46.99 97.79,48.26 97.79,60.96 | 97.79,60.96 97.79,70.61 | BAT1.GND 97.79,60.96 | C5.2 21.55,63.46 24.13,66.04 | 92.71,27.94 93.98,27.94 97.79,24.13 | 97.79,19.68 96.52,18.41 U$5.GND 92.71,18.41 90.17,20.32 | 90.17,20.32 90.17,21.17 IC1.1 | JP18.3 89.12,19.27 90.17,20.32 | DZ2.P$2 48.01,17.53 48.26,17.78 | IC2.3 IC2.4
  pour Bottom: 0,80.01 99.06,80.01 99.06,0 0,0
INT0
  Bottom 0.813: JP5.8 43.18,49.53 45.72,46.99 U1.33
INT1
  Bottom 0.813: U1.34 43.18,46.99 40.64,49.53 JP5.7
INT2
  Bottom 0.813: U1.35 40.64,46.99 38.1,49.53 JP5.6
IR
  Bottom 0.813: JP17.2 93.33,15.24 U$5.OUT
L1
  Bottom 0.813: JP12.4 38.1,59.69 35.56,62.23 LED2.A
L2
  Bottom 0.813: JP12.3 41.91,62.23 LED3.A
L3
  Bottom 0.813: JP12.2 44.45,62.23 LED4.A
L4
  Bottom 0.813: JP12.1 48.26,59.69 50.8,62.23 LED5.A
MISO
  Bottom 0.813: JP6.1 U1.20
MOSI
  Bottom 0.813: JP3.4 U1.27
N$1
  Bottom 0.813: U1.13 Y1.1 56.6,20.28 C1.1
N$2
  Bottom 0.813: Y1.2 58.55,17.91 60.96,20.32 | 60.96,20.32 U1.14 | C2.1 61,20.28 60.96,20.32
N$3
  Bottom 0.813: R5.P$2 12.7,49.53 11.43,50.8 D1.C
N$4
  Bottom 0.813: S1.1 18.49,17.22 R7.P$1
N$5
  Bottom 0.813: R8.P$1 20.32,45.72 25.4,50.8 JP5.1
N$6
  Bottom 0.813: R9.P$1 24.13,43.18 25.4,44.45 25.4,46.99 27.94,49.53 JP5.2
N$7
  Bottom 0.813: JP8.1 87.63,32.98 C6.1
N$8
  Bottom 0.813: IC2.2 Y2.1
N$9
  Bottom 0.813: R2.P$2 30.48,16.51 | 30.48,16.51 R1.P$1 | 30.48,16.51 JP1.1 33.02,17.78 34.29,19.05 34.29,20.07 DZ1.P$1
N$10
  Bottom 0.813: R4.P$2 38.1,16.51 | 38.1,16.51 R3.P$2 DZ2.P$1 | JP1.2 38.1,16.51
N$12
  Bottom 0.813: JP9.2 R3.P$1
N$13
  Bottom 0.813: JP9.1 R1.P$2
N$14
  Bottom 0.813: Y2.2 IC2.1 81.28,65.02 C10.2
N$15
  Bottom 0.813: R10.2 22.86,13.97 24.13,15.24 JP10.1
N$16
  Bottom 0.813: JP10.2 27.94,13.97 29.21,12.7 43.18,12.7 R11.2
N$17
  Bottom 0.813: C8.1 20.32,73.66 | 20.32,73.66 IC3.IN | D2.C 20.32,73.66
N$18
  Bottom 0.813: R13.2 62.23,10.16 64.77,7.62 64.77,4.32 U2.3
N$19
  Bottom 0.813: LED1.A 12.7,60.96 21.59,60.96 R14.P$2
N$20
  Bottom 0.813: LED2.K R15.P$2
N$21
  Bottom 0.813: LED3.K 39.37,67.31 R16.P$2
N$22
  Bottom 0.813: LED4.K 43.18,68.58 R17.P$2
N$23
  Bottom 0.813: R18.P$2 LED5.K
N$24
  Bottom 0.813: S2.1 60.96,68.22 JP13.2 62.87,67.31 R19.P$1
N$25
  Bottom 0.813: U2.15 95,6.1 95,6.6 90.93,10.67 90.93,11.68 89.92,12.7 R12.P$1
N$26
  Bottom 0.813: JP13.1 55.88,67.31 R20.P$1 54.18,66.67 S3.1
N$27
  Bottom 0.813: D3.A 85.72,60.96 91.44,55.24 92.46,55.24 BAT1.PWR@1
N$28
  Bottom 0.813: R21.P$2 88.9,53.34 JP15.1
N$29  (via drill 0.9 pad 1.78)
  Top 0.406: v83.57,63.5 82.55,63.5 82.04,62.99 75.95,62.99 75.44,63.5 73.91,63.5
  Top 0.813: 73.91,63.5 v73.66,63.75
  Bottom 0.813: 73.66,66.04 IC2.8 v73.66,63.75 | v73.66,63.75 D3.C | C10.1 85.09,65.02 v83.57,63.5 | D4.C 68.58,65.02 69.85,63.75 v73.66,63.75
N$30
  Bottom 0.813: IC2.7 JP14.3 70.87,69.47 R24.P$2
N$31
  Bottom 0.813: R22.P$2 86.36,55.63 JP16.1
PGC  (1 unrouted)
  Bottom 0.813: ICSP1.2 27.94,35.56 30.48,38.1 U1.39
PGD  (1 unrouted)
  Bottom 0.813: ICSP1.3 26.67,38.1 27.94,39.37 U1.40
RA4
  Bottom 0.813: U1.6 40.64,27.94 38.1,25.4 JP4.5
RB3
  Bottom 0.813: U1.36 38.1,46.99 35.56,49.53 JP5.5
RB4
  Bottom 0.813: U1.37 35.56,46.99 33.02,49.53 JP5.4
RB5
  Bottom 0.813: U1.38 33.02,46.99 30.48,49.53 JP5.3
RC0
  Bottom 0.813: JP6.6 U1.15
RC1
  Bottom 0.813: JP6.5 U1.16
RC2
  Bottom 0.813: JP6.4 U1.17
RC5
  Bottom 0.813: JP3.7 U1.24
RD2
  Bottom 0.813: JP3.10 U1.21
RD5
  Bottom 0.813: U1.28 JP3.3
RESCAP
  Bottom 0.813: JP8.2 JP2.P$1
RS
  Bottom 0.813: U2.4 67.06,4.83 72.39,10.16 JP11.6
RST  (via drill 0.9 pad 1.78)
  Top 0.813: v50.8,34.29 v58.42,34.29
  Bottom 0.813: R6.P$1 JP4.10 25.4,25.4 27.94,27.94 U1.1 27.94,31.75 30.48,34.29 v50.8,34.29 | v58.42,34.29 64.77,34.29 66.04,33.02 82.59,33.02 C6.2
RX1
  Bottom 0.813: JP2.P$3 64.77,39.37 63.5,40.64 U1.26 JP3.5
RX2
  Bottom 0.813: U1.30 JP3.1
SCK2
  Bottom 0.813: U1.19 JP6.2
SCL
  Bottom 0.813: R22.P$1 76.2,71.12 74.93,72.39 IC2.6 JP14.2 JP21.2
SCL1
  Bottom 0.813: U1.18 JP6.3
SDA
  Bottom 0.813: R21.P$1 78.74,57.15 78.74,73.66 77.47,74.93 IC2.5 JP14.1 JP21.1
SDA1
  Bottom 0.813: JP3.8 U1.23
SS2
  Bottom 0.813: JP3.9 U1.22
SWV
  Bottom 0.813: JP7.1 JP2.P$4
TX1  (via drill 0.9 pad 1.78)
  Top 0.813: v66.04,36.83 v66.04,41.91
  Bottom 0.813: JP2.P$2 v66.04,36.83 | v66.04,41.91 U1.25 JP3.6
TX2
  Bottom 0.813: JP3.2 U1.29
VPP  (via drill 0.9 pad 1.78)
  Top 0.813: v10.16,43.18 v10.16,30.48
  Bottom 0.813: v10.16,43.18 7.62,45.72 ICSP1.6 5.08,48.26 R5.P$1 | v10.16,30.48 13.97,26.67 R6.P$2 R7.P$2 C7.2

### Text on the board
tPlace: B1 | B2 | A | LM7805 | L | PCF8583 | L1 | L2 | L3 | L4 | GND | INT | 10uF | 100uF | 1N4001 | 1N4001 | Power | +5VCC | VCC | DTR | DS18B20 | VCC | TSOP4836 | 5V1 | 22pF | 22pF | 1W | GND | GND | 5V1 | IR | OUT | 16MHz | RESET | 10K | 10K | 10K | CONTRAST | E | RS | D4 | D5 | D6 | D7 | IN MAX+55v